# Altium schematic sheet MCU.SchDoc
size A; SheetNumber: 1; SheetTotal: 2
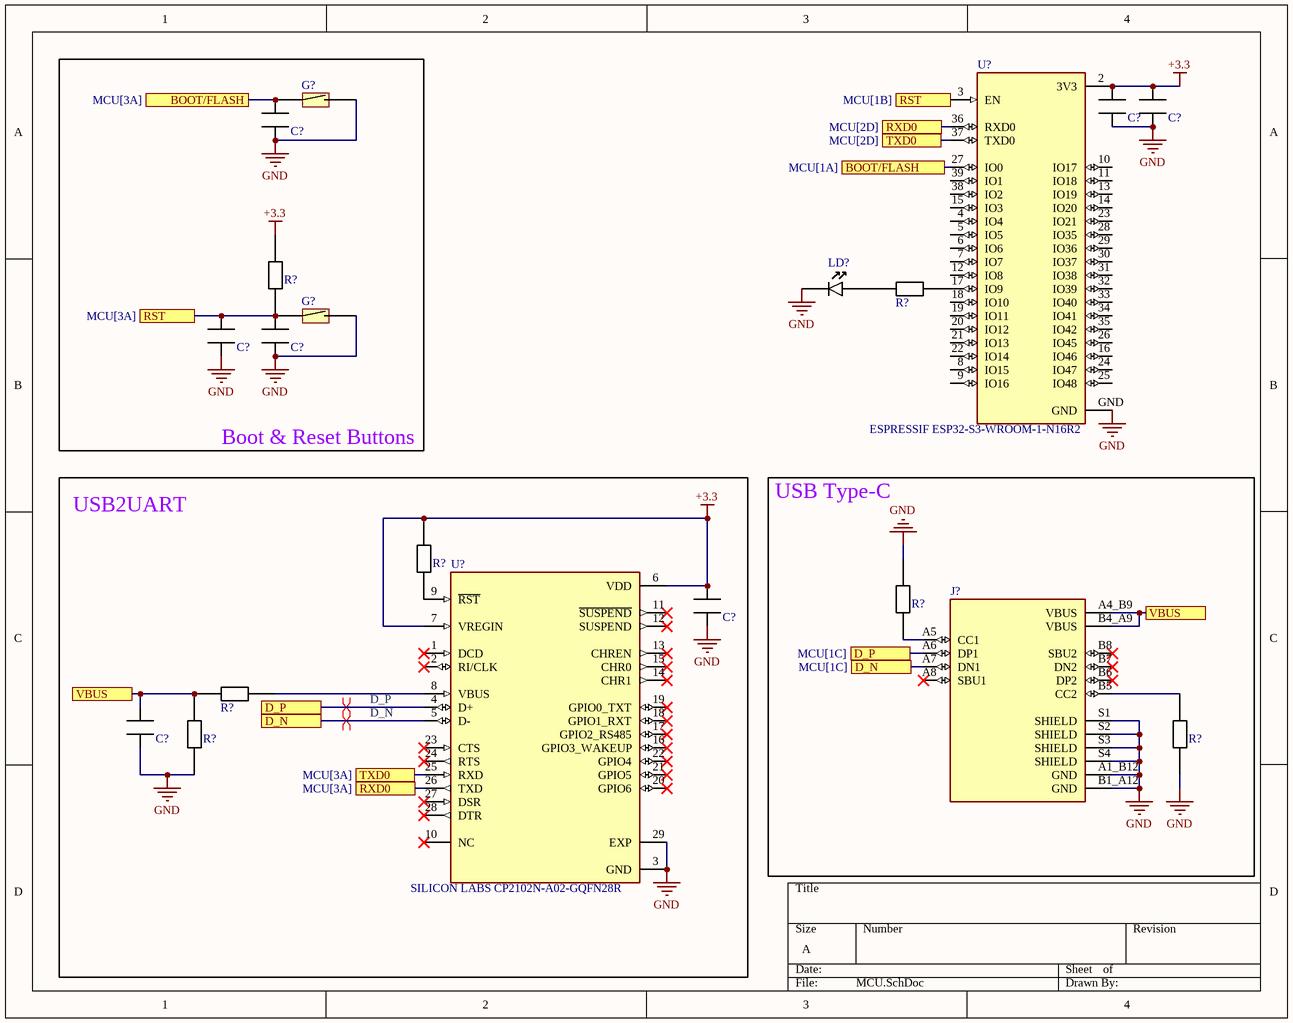
[diagram p0: MCU.SchDoc]

## Parts
(Parts that share a designator on the sheet are numbered #1, #2 ... from top to bottom, then left to right.)
C?#1  100nF  [CAP_0805]  (value not drawn)
C?#2  10uF  [CAP_0805]  (value not drawn)
C?#3  100nF  [CAP_0805]  (value not drawn)
C?#4  1uF  [CAP_0805]  (value not drawn)
C?#5  100nF  [CAP_0805]  (value not drawn)
C?#6  10uF  [CAP_0805]  (value not drawn)
C?#7  1uF  [CAP_0805]  (value not drawn)
G?#1  Push_Button  [Push_Button]  (value not drawn)
G?#2  Push_Button  [Push_Button]  (value not drawn)
J?  SHOU HAN TYPE-C 16PIN 2MD(073)  [HRO_TYPE-C-31-M-12]  (value not drawn)
LD?  LED_0805  [LED_0805]  (value not drawn)
R?#1  10k  [RES_0805]  (value not drawn)
R?#2  *  [RES_0805]  (value not drawn)
R?#3  1k  [RES_0805]  (value not drawn)
R?#4  *  [RES_0805]  (value not drawn)
R?#5  22.1k  [RES_0805]  (value not drawn)
R?#6  47.5k  [RES_0805]  (value not drawn)
R?#7  *  [RES_0805]  (value not drawn)
U?#1  ESPRESSIF ESP32-S3-WROOM-1-N16R2  [XCVR_ESP32-S3-WROOM-1-N16R2]
U?#2  SILICON LABS CP2102N-A02-GQFN28R  [IC_CP2102N-A02-GQFN28R]

## Blocks framed on the sheet
Boot & Reset Buttons: C?#3-C?#5 G?#1 G?#2 R?#1
USB2UART: C?#6 C?#7 R?#3 R?#5 R?#6 U?#2
USB Type-C: J? R?#4 R?#7

## Ports
BOOT/FLASH (see MCU[1A]), BOOT/FLASH (see MCU[3A]), D_N (see MCU[1C]), D_N (see MCU[3C]), D_P (see MCU[1C]), D_P (see MCU[3C]), RST (see MCU[1B]), RST (see MCU[3A]), RXD0 (see MCU[2D]), RXD0 (see MCU[3A]), TXD0 (see MCU[2D]), TXD0 (see MCU[3A]), VBUS (see MCU[1C]), VBUS (see MCU[4C])

## Nets
+3.3: C?#1.2 C?#2.2 C?#6.2 R?#1.2 R?#3.2 U?#1.2(3V3) U?#2.6(VDD) U?#2.7(VREGIN)
GND: C?#1.1 C?#2.1 C?#3.1 C?#4.1 C?#5.1 C?#6.1 C?#7.1 G?#1.1 G?#2.1 J?.A1_B12(GND) J?.B1_A12(GND) J?.S1(SHIELD) J?.S2(SHIELD) J?.S3(SHIELD) J?.S4(SHIELD) LD?.1 R?#4.2 R?#6.2 R?#7.1 U?#1.GND U?#2.3(GND) U?#2.29(EXP)
BOOT/FLASH: C?#3.2 G?#1.2 U?#1.27(IO0) ; port BOOT/FLASH
D_N: J?.A7(DN1) U?#2.5(D-) ; port D_N
D_P: J?.A6(DP1) U?#2.4(D+) ; port D_P
RST: C?#4.2 C?#5.2 G?#2.2 R?#1.1 U?#1.3(EN) ; port RST
RXD0: U?#1.36(RXD0) U?#2.26(TXD) ; port RXD0
TXD0: U?#1.37(TXD0) U?#2.25(RXD) ; port TXD0
VBUS: C?#7.2 J?.A4_B9(VBUS) J?.B4_A9(VBUS) R?#5.2 R?#6.1 ; port VBUS
NetJ?_A5: J?.A5(CC1) R?#4.1
NetJ?_B5: J?.B5(CC2) R?#7.2
NetLD?_2: LD?.2 R?#2.1
NetR?#2_2: R?#2.2 U?#1.17(IO9)
NetR?#3_1: R?#3.1 U?#2.9(~{RST})
NetR?#5_1: R?#5.1 U?#2.8(VBUS)

Not connected (* = marked no-connect by the designer): J? A8(SBU1)* B6(DP2)* B7(DN2)* B8(SBU2)*; U?#1 4(IO4) 5(IO5) 6(IO6) 7(IO7) 8(IO15) 9(IO16) 10(IO17) 11(IO18) 12(IO8) 13(IO19) 14(IO20) 15(IO3) 16(IO46) 18(IO10) 19(IO11) 20(IO12) 21(IO13) 22(IO14) 23(IO21) 24(IO47) 25(IO48) 26(IO45) 28(IO35) 29(IO36) 30(IO37) 31(IO38) 32(IO39) 33(IO40) 34(IO41) 35(IO42) 38(IO2) 39(IO1); U?#2 1(DCD)* 2(RI/CLK)* 10(NC)* 11(~{SUSPEND})* 12(SUSPEND)* 13(CHREN)* 14(CHR1)* 15(CHR0)* 16(GPIO3_WAKEUP)* 17(GPIO2_RS485)* 18(GPIO1_RXT)* 19(GPIO0_TXT)* 20(GPIO6)* 21(GPIO5)* 22(GPIO4)* 23(CTS)* 24(RTS)* 27(DSR)* 28(DTR)*

## Layout directives
differential pair: D_N, D_P

## Library data of the parts
C?#1-C?#7 = CAP_0805: note: any manufacturer
  C?#1 C?#3 C?#5: val: 100nF
  C?#2 C?#6: val: 10uF
  C?#4 C?#7: val: 1uF
G?#1 G?#2 = Push_Button: Push Button; note: any manufacturer; val: 3x6x4.3MM 2PIN SMT Tactile Tact Push Button button SPST-NO; sample link: https://www.lcsc.com/product-detail/C42420255.html
J? = TYPE-C-31-M-12: USB-C (USB TYPE-C) Receptacle Connector 16 Position Surface Mount, Right Angle; val: SHOU HAN TYPE-C 16PIN 2MD(073); note: *; sample link: https://www.lcsc.com/product-detail/C2765186.html?s_z=n_type%2520C
R?#1-R?#7 = RES_0805: note: any manufacturer
  R?#1: val: 10k
  R?#2 R?#4 R?#7: val: *
  R?#3: val: 1k
  R?#5: val: 22.1k
  R?#6: val: 47.5k
U?#1 = ESP32-S3-WROOM-1-N16R2: 2.4GHz ESP32-S3 On-board PCB Antenna -103.5dBm SMD,25.5x18mm RF Transceiver Modules and Modems RoHS; val: ESPRESSIF ESP32-S3-WROOM-1-N16R2; note: *; sample link: https://www.lcsc.com/product-detail/C2913205.html?s_z=n_esp32-s3
U?#2 = CP2102N-A02-GQFN28R: USB to UART USB 2.0 QFN-28-EP(5x5) Interface Controllers RoHS; val: SILICON LABS CP2102N-A02-GQFN28R; note: *; sample link: https://www.lcsc.com/product-detail/C964632.html?s_z=n_CP2102N-A02-GQFN28